# Altium schematic sheet UV_Watch_1.SchDoc (part 2 of 2)
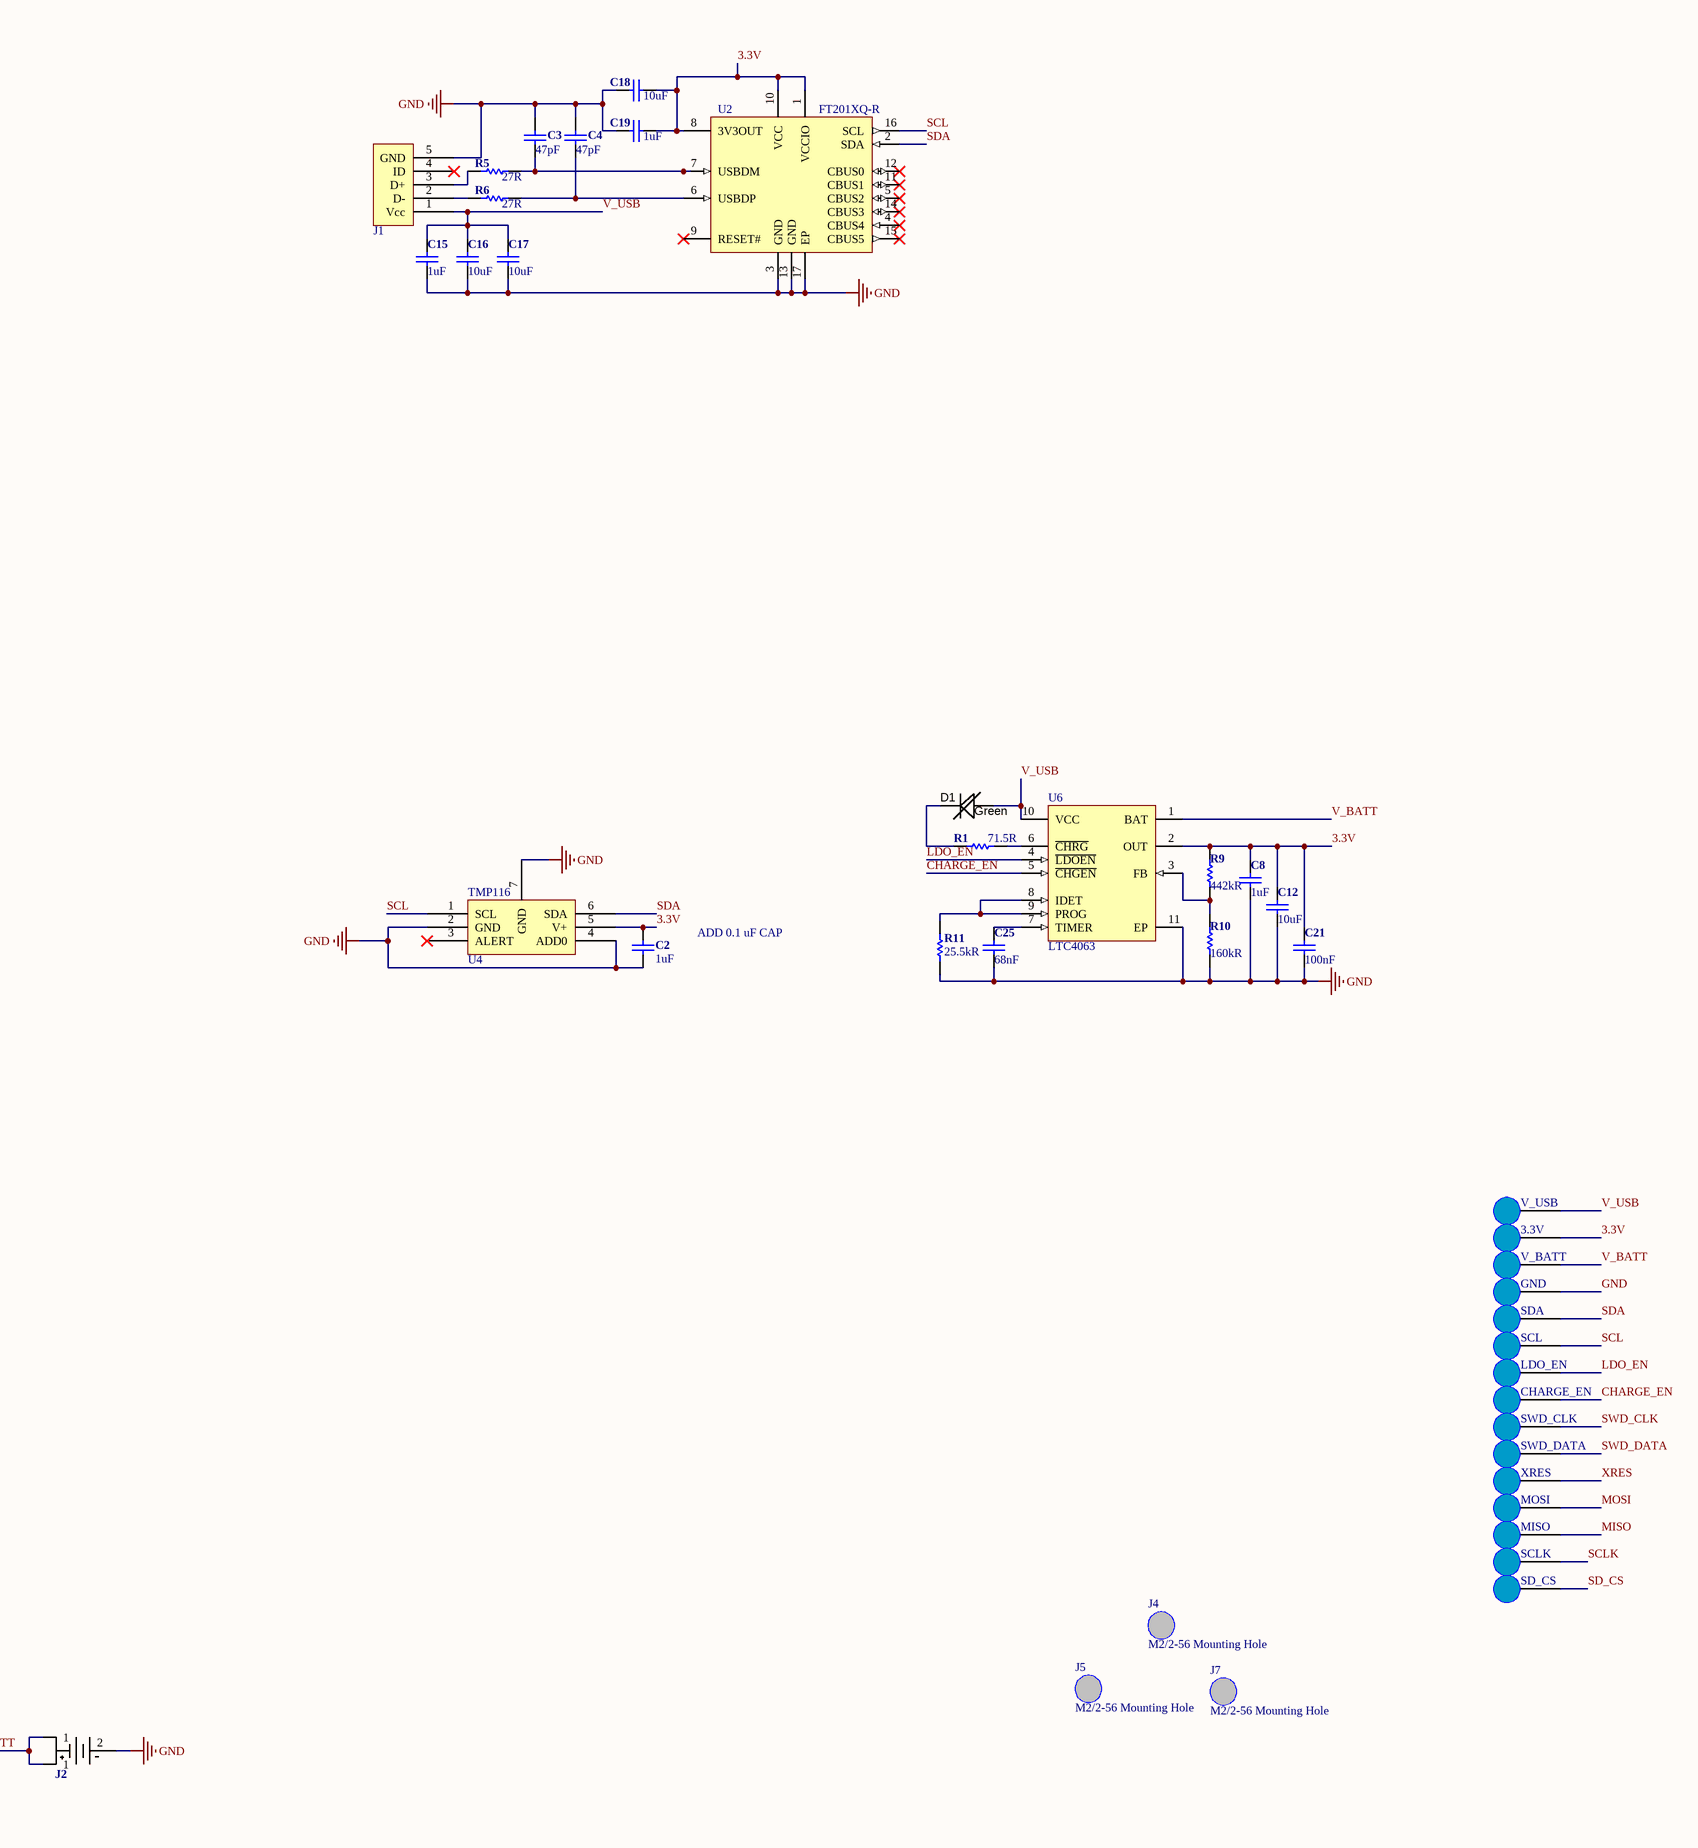
[diagram p2: UV_Watch_1.SchDoc, right]

## Library data of the parts
3.3V CHARGE_EN GND LDO_EN MISO MOSI SCL SCLK SD_CS SDA SWD_CLK SWD_DATA V_BATT V_USB XRES = Pogo-Pin Pad: Manufacturer: Harwin; Manufacturer Part Number: P13-2123; Description 1: HARWIN         P13-2123             PROBE, CONVEX, 1.27MM PITCH; Body Material: Bronze; Body Plating: Gold; Resistance: 0.03R; Current Rating: 3A; Contact Resistance: 30mR; Gender: Male; Mating Cycles: 1000000; Supplier 1: Mouser; Supplier Part Number 1: 855-P13-2123; Stock 1: 1373; Pricing 1: 1=3.36, 10=3.22, 50=2.82, 100=2.69, 1000=1.95, 10000=1.82 (USD); Material: Bronze; Contact Material: Copper; Min Operating Temperature: -40°C; Max Operating Temperature: 85°C; Package Quantity: 500; Length: 0.652inch; Depth: 1mm; Radiation Hardening: No; REACH SVHC: No SVHC; ComponentLink1URL: https://datasheet.ciiva.com/1454/1498711-1454531.pdf; ComponentLink1Description: https://datasheet.ciiva.com/1454/1498711-1454531.pdf; ComponentLink2URL: https://datasheet.ciiva.com/5229/p13-xx23-351008-5229722.pdf; ComponentLink2Description: https://datasheet.ciiva.com/5229/p13-xx23-351008-5229722.pdf
C1 C12 C13 C16-C18 = C-0805(2012): ___ OHM ___ mW 0805(2012) SMD; Manufacturer: Yageo; Manufacturer Part Number: CC0805ZKY5V5BB106; Description 1: CAP CER 10UF 6.3V Y5V 0805; Voltage Rating: 6.3V; Tolerance: 80%; Dielectric: Y5V; Supplier 1: Mouser; Supplier Part Number 1: 603-CC805ZKY5V5BB106; Stock 1: 8650; Pricing 1: 1=0.15, 10=0.076, 50=0.076, 100=0.033, 1000=0.027, 10000=0.023 (USD); Mount: Surface Mount; Case/Package: 0805; Number of Pins: 2; Case Code (Metric): 2012; Case Code (Imperial): 0805; Min Operating Temperature: -30°C; Max Operating Temperature: 85°C; Package Quantity: 1; Capacitance: 10uF; Packaging: Tape and Reel; Voltage Rating (DC): 6.3V; Composition: Ceramic; Length: 2mm; Height: 1.25mm; Width: 0.049inch; Thickness: 0.057inch; Depth: 1.25mm; Radiation Hardening: No; Lead Free: Lead Free; Halogen Free: Halogen Free; ComponentLink1URL: https://datasheet.ciiva.com/180/mlccorderingcode-180353.pdf; ComponentLink1Description: https://datasheet.ciiva.com/180/mlccorderingcode-180353.pdf; ComponentLink2URL: https://datasheet.ciiva.com/180/mlccorderingcode-180354.pdf; ComponentLink2Description: https://datasheet.ciiva.com/180/mlccorderingcode-180354.pdf; ComponentLink3URL: https://datasheet.ciiva.com/180/mlccorderingcode-180355.pdf; ComponentLink3Description: https://datasheet.ciiva.com/180/mlccorderingcode-180355.pdf; ComponentLink4URL: https://datasheet.ciiva.com/11465/upy-gphc-y5v-6-3v-to-50v-5-11465830.pdf; ComponentLink4Description: https://datasheet.ciiva.com/11465/upy-gphc-y5v-6-3v-to-50v-5-11465830.pdf; ComponentLink5URL: https://datasheet.ciiva.com/17436/upy-gphc-y5v-6-3v-to-50v-5-17436535.pdf; ComponentLink5Description: https://datasheet.ciiva.com/17436/upy-gphc-y5v-6-3v-to-50v-5-17436535.pdf; ComponentLink6URL: https://datasheet.ciiva.com/13211/upy-gp-np0-16v-to-50v-8-13211102.pdf; ComponentLink6Description: https://datasheet.ciiva.com/13211/upy-gp-np0-16v-to-50v-8-13211102.pdf
C2 C5 C8 C11 C15 C19 C20 C23 C24 = C-0805(2012): ___ OHM ___ mW 0805(2012) SMD; Manufacturer: Yageo; Manufacturer Part Number: CC0805KKX7R5BB105; Description 1: Cap Ceramic 1uF 6.3V X7R 10% SMD 0805 125C Blister T/R; Tolerance: 10%; Voltage Rating (DC): 6.3V; Dielectric: X7R; Supplier 1: Mouser; Supplier Part Number 1: 603-CC805KKX7R5BB105; Stock 1: 7735; Mount: Surface Mount; Case/Package: 0805; Weight: 0.000194oz; Case Code (Imperial): 0805; Case Code (Metric): 2012; Min Operating Temperature: -55°C; Max Operating Temperature: 125°C; Capacitance: 1uF; Packaging: Tape and Reel; Voltage Rating: 6.3V; Termination: SMD/SMT; Composition: Ceramic; Length: 2mm; Height: 1.25mm; Width: 0.049inch; Thickness: 0.057inch; Depth: 1.25mm; Radiation Hardening: No; Lead Free: Lead Free; Halogen Free: Halogen Free; ComponentLink1URL: https://datasheet.ciiva.com/13207/upy-gp-np0-16v-to-50v-8-13207753.pdf; ComponentLink1Description: https://datasheet.ciiva.com/13207/upy-gp-np0-16v-to-50v-8-13207753.pdf
  C2 C5 C8 C11 C15 C19 C20: Pricing 1: 1=0.14, 10=0.075, 50=0.075, 100=0.034, 1000=0.028, 10000=0.019 (USD)
  C23 C24: Pricing 1: 1=0.14, 10=0.075, 50=0.075, 100=0.034, 1000=0.028, 10000=0.02 (USD)
C3 C4 = C-0805(2012): ___ OHM ___ mW 0805(2012) SMD; Manufacturer: Vishay Vitramon; Manufacturer Part Number: VJ0805A470GXQPW1BC; Description 1: Multilayer Ceramic Capacitors MLCC - SMD/SMT 0805 47pF 10volts C0G 2%; Dielectric Material: Tantalum; Tolerance: 2%; Dielectric: C0G; Voltage Rating (DC): 10V; Supplier 1: Mouser; Supplier Part Number 1: 77-VJ0805A470GXQPBC; Stock 1: 31864; Pricing 1: 1=0.13, 10=0.13, 50=0.06, 100=0.044, 1000=0.026, 10000=0.026 (USD); Mount: Surface Mount; Case/Package: 0805; Weight: 0.000194oz; Case Code (Imperial): 0805; Case Code (Metric): 2012; Min Operating Temperature: -55°C; Max Operating Temperature: 125°C; Package Quantity: 15000; Packaging: Tape and Reel; Capacitance: 47pF; Termination: SMD/SMT; Length: 2mm; Height: 1.45mm; Width: 1.25mm; Depth: 1.25mm; Lead Free: Lead Free; ComponentLink1URL: https://datasheet.ciiva.com/11480/vjw1bcbascomseries-11480789.pdf; ComponentLink1Description: https://datasheet.ciiva.com/11480/vjw1bcbascomseries-11480789.pdf
C6 C9 C14 C21 C22 = C-0805(2012): ___ OHM ___ mW 0805(2012) SMD; Manufacturer: Wurth Electronics; Manufacturer Part Number: 885012207016; Description 1: 0.10µF 10V Ceramic Capacitor X7R 0805 (2012 Metric) 0.079" L x 0.049" W (2.00mm x 1.25mm); Voltage Rating: 10V; Tolerance: 10%; Supplier 1: Mouser; Supplier Part Number 1: 710-885012207016; Stock 1: 8228; Pricing 1: 1=0.08, 10=0.07, 50=0.05, 100=0.05, 1000=0.025, 10000=0.021 (USD); Mount: Surface Mount; Case/Package: 0805; Case Code (Metric): 2012; Case Code (Imperial): 0805; Min Operating Temperature: -55°C; Max Operating Temperature: 125°C; Packaging: Cut Tape; Capacitance: 100nF; Length: 0.079inch; Width: 0.049inch; Thickness: 0.035inch
C7 C10 = C-0805(2012): ___ OHM ___ mW 0805(2012) SMD; Manufacturer: Vishay Vitramon; Manufacturer Part Number: VJ0805Y103MXQPW1BC; Description 1: Multilayer Ceramic Capacitors MLCC - SMD/SMT 0805 0.01uF 10volts X7R 20%; Dielectric Material: Tantalum; Tolerance: 20%; Voltage Rating (DC): 10V; Dielectric: X7R; Supplier 1: Mouser; Supplier Part Number 1: 77-VJ0805Y103MXQPBC; Stock 1: 23611; Pricing 1: 1=0.1, 10=0.1, 50=0.07, 100=0.058, 1000=0.022, 10000=0.022 (USD); Mount: Surface Mount; Case/Package: 0805; Case Code (Imperial): 0805; Case Code (Metric): 2012; Min Operating Temperature: -55°C; Max Operating Temperature: 125°C; Capacitance: 10nF; Packaging: Tape and Reel; Package Quantity: 15000; Termination: SMD/SMT; Length: 2mm; Height: 1.45mm; Width: 1.25mm; Depth: 1.25mm; Lead Free: Lead Free; ComponentLink1URL: https://datasheet.ciiva.com/11497/vjw1bcbascomseries-11497433.pdf; ComponentLink1Description: https://datasheet.ciiva.com/11497/vjw1bcbascomseries-11497433.pdf
C25 = C-0805(2012): ___ OHM ___ mW 0805(2012) SMD; Manufacturer: Wurth Electronics; Manufacturer Part Number: 885012207044; Description 1: 0.068µF 16V Ceramic Capacitor X7R 0805 (2012 Metric) 0.079" L x 0.049" W (2.00mm x 1.25mm); Voltage Rating: 16V; Tolerance: 10%; Supplier 1: Mouser; Supplier Part Number 1: 710-885012207044; Stock 1: 3945; Pricing 1: 1=0.08, 10=0.07, 50=0.05, 100=0.05, 1000=0.025, 10000=0.021 (USD); Mount: Surface Mount; Case/Package: 0805; Case Code (Metric): 2012; Case Code (Imperial): 0805; Min Operating Temperature: -55°C; Max Operating Temperature: 125°C; Packaging: Tape and Reel; Capacitance: 68nF; Length: 0.079inch; Width: 0.049inch; Thickness: 0.035inch
D1 = LED_0805: LED, 0805 SMD; Manufacturer: Kingbright; Manufacturer Part Number: APHCM2012CGCK-F01; Description 1: LED 2X1.25MM LOPRO 570NM GRN SMD; Lens Colour: Clear; Luminous Intensity: 40mcd; Viewing Angle: 110°; Lens Style: Flat,Clear; Forward Current: 20mA; Forward Voltage: 2.1V; Dominant Wavelength: 570nm; Number of LEDs: 1; Supplier 1: Mouser; Supplier Part Number 1: 604-APHCM2012CGCK; Stock 1: 20488; Pricing 1: 1=0.2, 10=0.121, 50=0.121, 100=0.09, 1000=0.083, 10000=0.062 (USD); Mount: Surface Mount; Case/Package: 0805; Number of Pins: 2; Colour: Green; Case Code (Metric): 2012; Case Code (Imperial): 0805; Min Operating Temperature: -40°C; Max Operating Temperature: 85°C; Package Quantity: 1; Illumination Colour: Green; Packaging: Tape and Reel; Test Current: 20mA; Wavelength: 570nm; Length: 2mm; Height: 0.4mm; Width: 1.25mm; Lead Free: Lead Free; ComponentLink1URL: https://datasheet.ciiva.com/12403/aphcm2012cgck-f01-34366-12403909.pdf; ComponentLink1Description: https://datasheet.ciiva.com/12403/aphcm2012cgck-f01-34366-12403909.pdf; ComponentLink2URL: https://datasheet.ciiva.com/2113/aphcm2012cgck-f01-2113927.pdf; ComponentLink2Description: https://datasheet.ciiva.com/2113/aphcm2012cgck-f01-2113927.pdf; ComponentLink3URL: https://datasheet.ciiva.com/2113/aphcm2012cgck-f01-2113928.pdf; ComponentLink3Description: https://datasheet.ciiva.com/2113/aphcm2012cgck-f01-2113928.pdf; ComponentLink4URL: https://datasheet.ciiva.com/2113/aphcm2012cgck-f01-2113929.pdf; ComponentLink4Description: https://datasheet.ciiva.com/2113/aphcm2012cgck-f01-2113929.pdf; ComponentLink5URL: https://datasheet.ciiva.com/16494/aphcm2012cgck-f01-16494095.pdf; ComponentLink5Description: https://datasheet.ciiva.com/16494/aphcm2012cgck-f01-16494095.pdf
D2 = LED_0805: LED, 0805 SMD; Manufacturer: Kingbright; Manufacturer Part Number: APT2012LSECK/J4-PRV; Description 1: Orange 605nm LED Indication - Discrete 1.8V 0805 (2012 Metric); Lens Colour: Colorless; Lens Transparency: Clear; Luminous Intensity: 50mcd; Test Current: 2mA; Viewing Angle: 120°; Dominant Wavelength: 605nm; Forward Voltage: 1.8V; Supplier 1: Mouser; Supplier Part Number 1: 604-APT2012LSECKJ4RV; Stock 1: 9142; Pricing 1: 1=0.49, 10=0.304, 50=0.304, 100=0.226, 1000=0.176, 10000=0.137 (USD); Mount: Surface Mount; Case/Package: 0805; Colour: Orange; Case Code (Metric): 2012; Case Code (Imperial): 0805; Packaging: Tape and Reel; Length: 2mm; Height: 0.75mm; Width: 1.25mm; ComponentLink1URL: http://www.kingbrightusa.com/images/catalog/SPEC/APT2012LSECK-J4-PRV.pdf; ComponentLink1Description: http://www.kingbrightusa.com/images/catalog/SPEC/APT2012LSECK-J4-PRV.pdf; ComponentLink2URL: http://www.mouser.com/ds/2/216/APT2012LSECK-J4-PRV-535760.pdf; ComponentLink2Description: http://www.mouser.com/ds/2/216/APT2012LSECK-J4-PRV-535760.pdf
D3 = LED_0805: LED, 0805 SMD; Manufacturer: Kingbright; Manufacturer Part Number: APT2012LSECK/J3-PRV; Description 1: Red 625nm LED Indication - Discrete 1.8V 0805 (2012 Metric); Lens Colour: Colorless; Lens Transparency: Clear; Luminous Intensity: 40mcd; Test Current: 2mA; Viewing Angle: 120°; Dominant Wavelength: 625nm; Forward Voltage: 1.8V; Supplier 1: Mouser; Supplier Part Number 1: 604-APT2012LSECKJ3RV; Stock 1: 7340; Pricing 1: 1=0.49, 10=0.305, 50=0.305, 100=0.226, 1000=0.177, 10000=0.138 (USD); Mount: Surface Mount; Case/Package: 0805; Colour: Red; Case Code (Metric): 2012; Case Code (Imperial): 0805; Packaging: Tape and Reel; Length: 2mm; Height: 0.75mm; Width: 1.25mm; ComponentLink1URL: http://www.mouser.com/ds/2/216/APT2012LSECK-J3-PRV-535674.pdf; ComponentLink1Description: http://www.mouser.com/ds/2/216/APT2012LSECK-J3-PRV-535674.pdf; ComponentLink2URL: http://www.kingbrightusa.com/images/catalog/SPEC/APT2012LSECK-J3-PRV.pdf; ComponentLink2Description: http://www.kingbrightusa.com/images/catalog/SPEC/APT2012LSECK-J3-PRV.pdf
D4 = LED_0805: LED, 0805 SMD; Manufacturer: Kingbright; Manufacturer Part Number: APTD2012LQBC/D; Description 2: Blue 470nm LED Indication - Discrete 2.65V 0805 (2012 Metric); Lens Colour: Colorless; Lens Transparency: Clear; Luminous Intensity: 24mcd; Test Current: 2mA; Viewing Angle: 120°; Dominant Wavelength: 470nm; Forward Voltage: 2.65V; Supplier 1: Mouser; Supplier Part Number 1: 604-APTD2012LQBCD; Stock 1: 5707; Pricing 1: 1=0.46, 10=0.293, 50=0.293, 100=0.239, 1000=0.174, 10000=0.14 (USD); Supplier 2: Mouser; Supplier Part Number 2: 604-APT2012LVBCD; Stock 2: 2478; Pricing 2: 1=0.49, 10=0.313, 50=0.313, 100=0.256, 1000=0.186, 10000=0.15 (USD); Mount: Surface Mount; Case/Package: 0805; Colour: Blue; Case Code (Metric): 2012; Case Code (Imperial): 0805; Packaging: Tape and Reel; Length: 2mm; Height: 0.75mm; Width: 1.25mm; Lead Free: Lead Free; ComponentLink1URL: http://www.mouser.com/ds/2/216/APT2012LVBC-D-535767.pdf; ComponentLink1Description: http://www.mouser.com/ds/2/216/APT2012LVBC-D-535767.pdf; ComponentLink2URL: http://www.kingbrightusa.com/images/catalog/SPEC/APT2012LVBC-D.pdf; ComponentLink2Description: http://www.kingbrightusa.com/images/catalog/SPEC/APT2012LVBC-D.pdf
J1 = USB: USB_Connector_5P_MICRO_USB_FCI; Manufacturer: Amphenol FCI; Manufacturer Part Number: 10118194-0001LF; Connector Type: USB - micro B; Number of Contacts: 5; Gender: Receptacle; Specifications: USB 2.0; Number of Ports: 1; Current Rating: 1.8A per Contact; Voltage - Rated: 100VAC; Mating Cycles: 10000; Shielding: Shielded; Material Flammability Rating: UL94 V-0; Supplier 1: Digi-Key; RoHS: RoHS Compliant; Category: Connectors, Interconnects; Stock 1: 267893; Pricing 1: 1=0.46, 10=0.437, 25=0.3744, 50=0.318, 100=0.3056, 250=0.27444, 500=0.26196 (USD); Packaging: Cut Tape (CT); Part Status: Active; Mounting Type: Surface Mount, Right Angle; Through Hole; Mounting Feature: Horizontal; Termination: Solder; Features: Solder Retention; Ingress Protection: -; Operating Temperature: -30°C ~ 80°C; Contact Finish: Gold; Shell/Shielding Material: Steel, Stainless; Insulation Color: Black; ComponentLink1URL: http://portal.fciconnect.com/Comergent//fci/drawing/10118194.pdf; ComponentLink1Description: http://portal.fciconnect.com/Comergent//fci/drawing/10118194.pdf; Supplier Part Number 1: 609-4618-1-ND
J2 = BAT-HLD-001: Header, 2 pin, .1 pitch; Manufacturer: Linx; Description 1: HOLDER BATTERY 20MM COIN; Number of Cells: 1; Supplier 1: Mouser; Supplier Part Number 1: 712-BAT-HLD-001; Manufacturer Part Number: BAT-HLD-001; Stock 1: 81336; Pricing 1: 1=0.28, 10=0.28, 50=0.257, 100=0.233, 1000=0.204, 10000=0.183 (USD); Mount: Surface Mount,PCB; Package Quantity: 1000; Packaging: Bulk; Termination: SMD/SMT; Lead Free: Lead Free; ComponentLink1URL: https://datasheet.ciiva.com/4/bat-hld-001-4035.pdf; ComponentLink1Description: https://datasheet.ciiva.com/4/bat-hld-001-4035.pdf; ComponentLink2URL: https://datasheet.ciiva.com/4642/bat-hld-001-220194-4642567.pdf; ComponentLink2Description: https://datasheet.ciiva.com/4642/bat-hld-001-220194-4642567.pdf; ComponentLink3URL: https://datasheet.ciiva.com/16207/bat-hld-001-16207212.pdf; ComponentLink3Description: https://datasheet.ciiva.com/16207/bat-hld-001-16207212.pdf
J3 = 693071010811: Wurth CONN MICRO SD CARD PUSH-PUSH R/A; Manufacturer: Wurth Electronics; Description 1: WURTH ELEKTRONIK         693071010811             CONNECTOR, MICRO SD, SMT, R/A, 8WAY; Connector Type: Connector; Number of Contacts: 8; Supplier 1: Digi-Key; Supplier Part Number 1: 732-3819-1-ND; Manufacturer Part Number: 693071010811; Stock 1: 4983; Pricing 1: 1=2.92, 10=2.856, 50=2.513, 100=2.399, 500=2.056 (USD); Mount: Surface Mount; Contact Material: Copper,Gold,Copper Alloy; Contact Plating: Gold; Min Operating Temperature: -25°C; Max Operating Temperature: 85°C; Package Quantity: 1; Packaging: Tape and Reel; Length: 14mm; Height: 1.98mm; Width: 15.2mm; REACH SVHC: Unknown; Lead Free: Lead Free; ComponentLink1URL: https://datasheet.ciiva.com/6935/693071010811-6935152.pdf; ComponentLink1Description: https://datasheet.ciiva.com/6935/693071010811-6935152.pdf; ComponentLink2URL: https://datasheet.ciiva.com/25605/0900766b81113f2e-25605369.pdf; ComponentLink2Description: https://datasheet.ciiva.com/25605/0900766b81113f2e-25605369.pdf; ComponentLink3URL: https://datasheet.ciiva.com/6935/693071010811-6935146.pdf; ComponentLink3Description: https://datasheet.ciiva.com/6935/693071010811-6935146.pdf; ComponentLink4URL: https://datasheet.ciiva.com/1104/1759178-1104796.pdf; ComponentLink4Description: https://datasheet.ciiva.com/1104/1759178-1104796.pdf
R1 = R-0805(2012): ___ OHM ___ mW 0805(2012) SMD; Manufacturer: Yageo; Manufacturer Part Number: RC0805FR-0771R5L; Description 1: RES SMD 71.5 OHM 1% 1/8W 0805; Tolerance: 1%; Power Rating: 125mW; Voltage Rating (DC): 150V; Supplier 1: Mouser; Supplier Part Number 1: 603-RC0805FR-0771R5L; Stock 1: 25750; Pricing 1: 1=0.1, 10=0.015, 50=0.015, 100=0.005, 1000=0.004, 10000=0.003 (USD); Case/Package: 0805; Resistance: 71.5R; Lead Free: Lead Free; ComponentLink1URL: http://components.arrow.com/part/dataview/0323_00201025; ComponentLink1Description: http://components.arrow.com/part/dataview/0323_00201025; ComponentLink2URL: http://www.yageo.com.tw/exep/pages/download/literatures/PYu-R_INT-thick_7.pdf; ComponentLink2Description: http://www.yageo.com.tw/exep/pages/download/literatures/PYu-R_INT-thick_7.pdf
R2 = R-0805(2012): ___ OHM ___ mW 0805(2012) SMD; Manufacturer: Yageo; Manufacturer Part Number: AC0805JR-071KL; Description 1: Thick Film Resistors - SMD 1/8W 1 kOhm 5%; Tolerance: 5%; Power Rating: 125mW; Voltage Rating: 150V; Temperature Coefficient: 100ppm/°C; Supplier 1: Mouser; Supplier Part Number 1: 603-AC0805JR-071KL; Stock 1: 51600; Pricing 1: 1=0.1, 10=0.023, 50=0.023, 100=0.008, 1000=0.006, 10000=0.003 (USD); Case/Package: 0805; Case Code (Imperial): 0805; Case Code (Metric): 2012; Contact Plating: Tin,Matte; Min Operating Temperature: -55°C; Max Operating Temperature: 155°C; Resistance: 1kR; Packaging: Tape and Reel; Composition: Thick Film; Termination: SMD/SMT; Number of Terminations: 2; Max Power Dissipation: 125mW; Length: 0.079inch; Height: 0.024inch; Width: 1.25mm; Radiation Hardening: No; Lead Free: Lead Free; ComponentLink1URL: http://www.yageo.com/documents/recent/PYu-AC_51_RoHS_L_2_revised.pdf; ComponentLink1Description: http://www.yageo.com/documents/recent/PYu-AC_51_RoHS_L_2_revised.pdf; ComponentLink2URL: http://www.mouser.com/ds/2/447/yageodocoutput-1111992.pdf; ComponentLink2Description: http://www.mouser.com/ds/2/447/yageodocoutput-1111992.pdf; ComponentLink3URL: http://www.yageo.com/NewPortal/yageodocoutput?fileName=/pdf/R-Chip/PYu-AC_51_RoHS_L_6.pdf; ComponentLink3Description: http://www.yageo.com/NewPortal/yageodocoutput?fileName=/pdf/R-Chip/PYu-AC_51_RoHS_L_6.pdf
R3 = R-0805(2012): ___ OHM ___ mW 0805(2012) SMD; Manufacturer: Yageo; Manufacturer Part Number: RC0805FR-07150RL; Description 1: RES SMD 150 OHM 1% 1/8W 0805; Power Rating: 125mW; Tolerance: 1%; Voltage Rating: 150V; Temperature Coefficient: 100ppm/°C; Supplier 1: Mouser; Supplier Part Number 1: 603-RC0805FR-07150RL; Stock 1: 18073; Pricing 1: 1=0.1, 10=0.016, 50=0.016, 100=0.006, 1000=0.004, 10000=0.003 (USD); Case/Package: 0805; Number of Pins: 2; Case Code (Metric): 2012; Case Code (Imperial): 0805; Min Operating Temperature: -55°C; Max Operating Temperature: 155°C; Resistance: 150R; Voltage Rating (DC): 150V; Package Quantity: 1; Packaging: Tape and Reel; Composition: Thick Film; Number of Terminations: 2; Termination: SMD/SMT; Military Standard: Not; Max Power Dissipation: 125mW; Length: 2mm; Height: 0.024inch; Width: 0.049inch; Depth: 1.25mm; REACH SVHC: Unknown; Lead Free: Lead Free; ComponentLink1URL: https://datasheet.ciiva.com/11819/0900766b8106beab-11819782.pdf; ComponentLink1Description: https://datasheet.ciiva.com/11819/0900766b8106beab-11819782.pdf; ComponentLink2URL: https://datasheet.ciiva.com/2456/pyu-r-int-thick-7-2456999.pdf; ComponentLink2Description: https://datasheet.ciiva.com/2456/pyu-r-int-thick-7-2456999.pdf; ComponentLink3URL: https://datasheet.ciiva.com/2457/pyu-r-int-thick-7-2457000.pdf; ComponentLink3Description: https://datasheet.ciiva.com/2457/pyu-r-int-thick-7-2457000.pdf; ComponentLink4URL: https://datasheet.ciiva.com/2457/pyu-r-int-thick-7-2457001.pdf; ComponentLink4Description: https://datasheet.ciiva.com/2457/pyu-r-int-thick-7-2457001.pdf; ComponentLink5URL: https://datasheet.ciiva.com/12668/rc0805-12668251.pdf; ComponentLink5Description: https://datasheet.ciiva.com/12668/rc0805-12668251.pdf; ComponentLink6URL: https://datasheet.ciiva.com/7660/38627-7660798.pdf; ComponentLink6Description: https://datasheet.ciiva.com/7660/38627-7660798.pdf; ComponentLink7URL: https://datasheet.ciiva.com/46447/444164-46447566.pdf; ComponentLink7Description: https://datasheet.ciiva.com/46447/444164-46447566.pdf
R4 R8 R12-R14 R18 R20 = R-0805(2012): ___ OHM ___ mW 0805(2012) SMD; Manufacturer: Yageo; Manufacturer Part Number: AC0805JR-074K7L; Description 1: Thick Film Resistors - SMD 1/8W 4.7K ohm 5%; Power Rating: 125mW; Tolerance: 5%; Voltage Rating: 150V; Temperature Coefficient: 100ppm/°C; Supplier 1: Mouser; Supplier Part Number 1: 603-AC0805JR-074K7L; Pricing 1: 1=0.1, 10=0.023, 50=0.023, 100=0.008, 1000=0.006, 10000=0.003 (USD); Case/Package: 0805; Case Code (Imperial): 0805; Case Code (Metric): 2012; Contact Plating: Tin,Matte; Min Operating Temperature: -55°C; Max Operating Temperature: 155°C; Packaging: Tape and Reel; Resistance: 4.7kR; Composition: Thick Film; Termination: SMD/SMT; Number of Terminations: 2; Max Power Dissipation: 125mW; Length: 0.079inch; Height: 0.024inch; Width: 1.25mm; Radiation Hardening: No; ComponentLink1URL: http://www.mouser.com/ds/2/447/yageodocoutput-1111992.pdf; ComponentLink1Description: http://www.mouser.com/ds/2/447/yageodocoutput-1111992.pdf; ComponentLink2URL: http://www.yageo.com/NewPortal/yageodocoutput?fileName=/pdf/R-Chip/PYu-AC_51_RoHS_L_6.pdf; ComponentLink2Description: http://www.yageo.com/NewPortal/yageodocoutput?fileName=/pdf/R-Chip/PYu-AC_51_RoHS_L_6.pdf; ComponentLink3URL: http://www.yageo.com/documents/recent/PYu-AC_51_RoHS_L_2_revised.pdf; ComponentLink3Description: http://www.yageo.com/documents/recent/PYu-AC_51_RoHS_L_2_revised.pdf
  R4 R12 R13: Stock 1: 79084
  R8 R14 R18 R20: Stock 1: 78734
R5 R6 = R-0805(2012): ___ OHM ___ mW 0805(2012) SMD; Manufacturer: Yageo; Manufacturer Part Number: RC0805JR-0727RL; Description 1: RES SMD 27 OHM 5% 1/8W 0805; Power Rating: 125mW; Tolerance: 5%; Voltage Rating: 150V; Temperature Coefficient: 100ppm/°C; Supplier 1: Mouser; Supplier Part Number 1: 603-RC0805JR-0727RL; Stock 1: 4359; Pricing 1: 1=0.1, 10=0.013, 50=0.013, 100=0.005, 1000=0.003, 10000=0.003 (USD); Case/Package: 0805; Weight: 0.000194oz; Case Code (Metric): 2012; Case Code (Imperial): 0805; Contact Plating: Tin,Lead,Matte; Min Operating Temperature: -55°C; Max Operating Temperature: 155°C; Resistance: 27R; Package Quantity: 1; Packaging: Tape and Reel; Composition: Thick Film; Number of Terminations: 2; Termination: SMD/SMT; Military Standard: Not; Max Power Dissipation: 125mW; Length: 2mm; Height: 0.024inch; Width: 0.049inch; Depth: 1.25mm; Radiation Hardening: No; REACH SVHC: Unknown; Lead Free: Lead Free; ComponentLink1URL: https://datasheet.ciiva.com/2456/pyu-r-int-thick-7-2456049.pdf; ComponentLink1Description: https://datasheet.ciiva.com/2456/pyu-r-int-thick-7-2456049.pdf; ComponentLink2URL: https://datasheet.ciiva.com/2456/pyu-r-int-thick-7-2456050.pdf; ComponentLink2Description: https://datasheet.ciiva.com/2456/pyu-r-int-thick-7-2456050.pdf; ComponentLink3URL: https://datasheet.ciiva.com/2456/pyu-r-int-thick-7-2456051.pdf; ComponentLink3Description: https://datasheet.ciiva.com/2456/pyu-r-int-thick-7-2456051.pdf; ComponentLink4URL: https://datasheet.ciiva.com/17050/rc0805-17050396.pdf; ComponentLink4Description: https://datasheet.ciiva.com/17050/rc0805-17050396.pdf; ComponentLink5URL: https://datasheet.ciiva.com/7941/442941-7941933.pdf; ComponentLink5Description: https://datasheet.ciiva.com/7941/442941-7941933.pdf; ComponentLink6URL: https://datasheet.ciiva.com/7941/442941-7941934.pdf; ComponentLink6Description: https://datasheet.ciiva.com/7941/442941-7941934.pdf; ComponentLink7URL: https://datasheet.ciiva.com/12577/rc0805-12577759.pdf; ComponentLink7Description: https://datasheet.ciiva.com/12577/rc0805-12577759.pdf
R7 R19 R21 R24 = R-0805(2012): ___ OHM ___ mW 0805(2012) SMD; Manufacturer: Yageo; Manufacturer Part Number: RC0805FR-07100KL; Description 1: RES SMD 100K OHM 1% 1/8W 0805; Tolerance: 1%; Voltage Rating (DC): 150V; Temperature Coefficient: 100ppm/°C; Power Rating: 125mW; Supplier 1: Mouser; Supplier Part Number 1: 603-RC0805FR-07100KL; Pricing 1: 1=0.1, 10=0.016, 50=0.016, 100=0.006, 1000=0.004, 10000=0.003 (USD); Case/Package: 0805; Number of Pins: 2; Case Code (Metric): 2012; Case Code (Imperial): 0805; Min Operating Temperature: -55°C; Max Operating Temperature: 155°C; Resistance: 100kR; Packaging: Tape and Reel; Composition: Thick Film; Voltage Rating: 150V; Package Quantity: 1; Number of Terminations: 2; Termination: SMD/SMT; Military Standard: Not; Max Power Dissipation: 125mW; Length: 2mm; Height: 0.024inch; Width: 0.049inch; Depth: 1.25mm; Lead Pitch: 0.4mm; REACH SVHC: Unknown; Lead Free: Lead Free; ComponentLink1URL: https://datasheet.ciiva.com/2457/pyu-r-int-thick-7-2457017.pdf; ComponentLink1Description: https://datasheet.ciiva.com/2457/pyu-r-int-thick-7-2457017.pdf; ComponentLink2URL: https://datasheet.ciiva.com/12667/rc0805-12667001.pdf; ComponentLink2Description: https://datasheet.ciiva.com/12667/rc0805-12667001.pdf; ComponentLink3URL: https://datasheet.ciiva.com/2457/pyu-r-int-thick-7-2457018.pdf; ComponentLink3Description: https://datasheet.ciiva.com/2457/pyu-r-int-thick-7-2457018.pdf; ComponentLink4URL: https://datasheet.ciiva.com/11808/0900766b8106beab-11808858.pdf; ComponentLink4Description: https://datasheet.ciiva.com/11808/0900766b8106beab-11808858.pdf; ComponentLink5URL: https://datasheet.ciiva.com/16747/rc0805-16747226.pdf; ComponentLink5Description: https://datasheet.ciiva.com/16747/rc0805-16747226.pdf; ComponentLink6URL: https://datasheet.ciiva.com/2457/pyu-r-int-thick-7-2457019.pdf; ComponentLink6Description: https://datasheet.ciiva.com/2457/pyu-r-int-thick-7-2457019.pdf; ComponentLink7URL: https://datasheet.ciiva.com/7660/38627-7660796.pdf; ComponentLink7Description: https://datasheet.ciiva.com/7660/38627-7660796.pdf; ComponentLink8URL: https://datasheet.ciiva.com/7941/1697719-7941676.pdf; ComponentLink8Description: https://datasheet.ciiva.com/7941/1697719-7941676.pdf; ComponentLink9URL: https://datasheet.ciiva.com/7941/1686128-7941677.pdf; ComponentLink9Description: https://datasheet.ciiva.com/7941/1686128-7941677.pdf; ComponentLink10URL: https://datasheet.ciiva.com/7941/1697719-7941678.pdf; ComponentLink10Description: https://datasheet.ciiva.com/7941/1697719-7941678.pdf; ComponentLink11URL: https://datasheet.ciiva.com/22747/444164-22747534.pdf; ComponentLink11Description: https://datasheet.ciiva.com/22747/444164-22747534.pdf
  R7 R19 R21: Stock 1: 159583
  R24: Stock 1: 94214
R9 = R-0805(2012): ___ OHM ___ mW 0805(2012) SMD; Manufacturer: Yageo; Manufacturer Part Number: RC0805FR-07442KL; Description 1: Thick Film Resistors - SMD 442K OHM 1%; Tolerance: 1%; Power Rating: 125mW; Voltage Rating: 150V; Temperature Coefficient: 100ppm/°C; Supplier 1: Mouser; Supplier Part Number 1: 603-RC0805FR-07442KL; Stock 1: 22218; Pricing 1: 1=0.1, 10=0.016, 50=0.016, 100=0.006, 1000=0.004, 10000=0.003 (USD); Case/Package: 0805; Case Code (Imperial): 0805; Case Code (Metric): 2012; Contact Plating: Tin,Matte; Min Operating Temperature: -55°C; Max Operating Temperature: 155°C; Resistance: 442kR; Packaging: Tape and Reel; Termination: SMD/SMT; Composition: Thick Film; Military Standard: Not; Voltage Rating (DC): 150V; Length: 2mm; Height: 0.5mm; Width: 1.25mm; Depth: 1.25mm; Radiation Hardening: No; Lead Free: Lead Free; ComponentLink1URL: http://www.mouser.com/ds/2/447/Yageo_08112016_RC0805-968729.pdf; ComponentLink1Description: http://www.mouser.com/ds/2/447/Yageo_08112016_RC0805-968729.pdf; ComponentLink2URL: http://components.arrow.com/part/dataview/0323_03537347; ComponentLink2Description: http://components.arrow.com/part/dataview/0323_03537347; ComponentLink3URL: http://www.yageo.com.tw/exep/pages/download/literatures/PYu-R_INT-thick_7.pdf; ComponentLink3Description: http://www.yageo.com.tw/exep/pages/download/literatures/PYu-R_INT-thick_7.pdf; ComponentLink4URL: http://www.yageo.com/documents/recent/PYu-RC0805_51_RoHS_L_5.pdf; ComponentLink4Description: http://www.yageo.com/documents/recent/PYu-RC0805_51_RoHS_L_5.pdf
R10 = R-0805(2012): ___ OHM ___ mW 0805(2012) SMD; Manufacturer: Yageo; Manufacturer Part Number: RC0805FR-07160KL; Description 1: RES SMD 160K OHM 1% 1/8W 0805; Tolerance: 1%; Power Rating: 125mW; Voltage Rating: 150V; Temperature Coefficient: 100ppm/°C; Supplier 1: Mouser; Supplier Part Number 1: 603-RC0805FR-07160KL; Stock 1: 12686; Pricing 1: 1=0.1, 10=0.016, 50=0.016, 100=0.006, 1000=0.004, 10000=0.003 (USD); Case/Package: 0805; Case Code (Metric): 2012; Case Code (Imperial): 0805; Min Operating Temperature: -55°C; Max Operating Temperature: 155°C; Package Quantity: 1; Resistance: 160kR; Packaging: Tape and Reel; Composition: Thick Film; Number of Terminations: 2; Termination: SMD/SMT; Max Power Dissipation: 125mW; Voltage Rating (DC): 150V; Length: 2mm; Height: 0.5mm; Width: 0.049inch; Depth: 1.25mm; Lead Free: Lead Free; ComponentLink1URL: https://datasheet.ciiva.com/11808/0900766b8106beab-11808868.pdf; ComponentLink1Description: https://datasheet.ciiva.com/11808/0900766b8106beab-11808868.pdf; ComponentLink2URL: https://datasheet.ciiva.com/17061/rc0805-17061772.pdf; ComponentLink2Description: https://datasheet.ciiva.com/17061/rc0805-17061772.pdf; ComponentLink3URL: https://datasheet.ciiva.com/2457/pyu-r-int-thick-7-2457005.pdf; ComponentLink3Description: https://datasheet.ciiva.com/2457/pyu-r-int-thick-7-2457005.pdf; ComponentLink4URL: https://datasheet.ciiva.com/2457/pyu-r-int-thick-7-2457006.pdf; ComponentLink4Description: https://datasheet.ciiva.com/2457/pyu-r-int-thick-7-2457006.pdf; ComponentLink5URL: https://datasheet.ciiva.com/2457/pyu-r-int-thick-7-2457007.pdf; ComponentLink5Description: https://datasheet.ciiva.com/2457/pyu-r-int-thick-7-2457007.pdf
R11 = R-0805(2012): ___ OHM ___ mW 0805(2012) SMD; Manufacturer: Yageo; Manufacturer Part Number: RC0805FR-0725K5L; Description 1: RES SMD 25.5K OHM 1% 1/8W 0805; Power Rating: 125mW; Tolerance: 1%; Voltage Rating: 150V; Temperature Coefficient: 100ppm/°C; Supplier 1: Mouser; Supplier Part Number 1: 603-RC0805FR-0725K5L; Stock 1: 6188; Pricing 1: 1=0.1, 10=0.016, 50=0.016, 100=0.006, 1000=0.004, 10000=0.003 (USD); Case/Package: 0805; Case Code (Metric): 2012; Case Code (Imperial): 0805; Min Operating Temperature: -55°C; Max Operating Temperature: 155°C; Package Quantity: 1; Resistance: 25.5kR; Packaging: Tape and Reel; Composition: Thick Film; Number of Terminations: 2; Termination: SMD/SMT; Military Standard: Not; Max Power Dissipation: 125mW; Voltage Rating (DC): 150V; Length: 0.079inch; Height: 0.024inch; Width: 0.049inch; Depth: 1.25mm; Lead Free: Lead Free; ComponentLink1URL: https://datasheet.ciiva.com/2509/pyu-r-int-thick-7-2509489.pdf; ComponentLink1Description: https://datasheet.ciiva.com/2509/pyu-r-int-thick-7-2509489.pdf; ComponentLink2URL: https://datasheet.ciiva.com/2509/pyu-r-int-thick-7-2509490.pdf; ComponentLink2Description: https://datasheet.ciiva.com/2509/pyu-r-int-thick-7-2509490.pdf; ComponentLink3URL: https://datasheet.ciiva.com/2509/pyu-r-int-thick-7-2509491.pdf; ComponentLink3Description: https://datasheet.ciiva.com/2509/pyu-r-int-thick-7-2509491.pdf; ComponentLink4URL: https://datasheet.ciiva.com/5558/rc0805-5558218.pdf; ComponentLink4Description: https://datasheet.ciiva.com/5558/rc0805-5558218.pdf
R15 R16 = R-0805(2012): ___ OHM ___ mW 0805(2012) SMD; Manufacturer: Yageo; Manufacturer Part Number: RC0805FR-0780R6L; Description 1: RES SMD 80.6 OHM 1% 1/8W 0805; Tolerance: 1%; Power Rating: 125mW; Voltage Rating: 150V; Temperature Coefficient: 100ppm/°C; Supplier 1: Mouser; Supplier Part Number 1: 603-RC0805FR-0780R6L; Stock 1: 39348; Pricing 1: 1=0.1, 10=0.016, 50=0.016, 100=0.006, 1000=0.004, 10000=0.003 (USD); Case/Package: 0805; Case Code (Imperial): 0805; Case Code (Metric): 2012; Contact Plating: Tin,Matte; Min Operating Temperature: -55°C; Max Operating Temperature: 155°C; Resistance: 80.6R; Packaging: Tape and Reel; Package Quantity: 1; Termination: SMD/SMT; Composition: Thick Film; Number of Terminations: 2; Military Standard: Not; Max Power Dissipation: 125mW; Voltage Rating (DC): 150V; Length: 2mm; Height: 0.024inch; Width: 1.25mm; Depth: 1.25mm; Radiation Hardening: No; Lead Free: Lead Free; ComponentLink1URL: https://datasheet.ciiva.com/12560/rc0805-257173-12560565.pdf; ComponentLink1Description: https://datasheet.ciiva.com/12560/rc0805-257173-12560565.pdf; ComponentLink2URL: https://datasheet.ciiva.com/2457/pyu-r-int-thick-7-2457350.pdf; ComponentLink2Description: https://datasheet.ciiva.com/2457/pyu-r-int-thick-7-2457350.pdf; ComponentLink3URL: https://datasheet.ciiva.com/2457/pyu-r-int-thick-7-2457351.pdf; ComponentLink3Description: https://datasheet.ciiva.com/2457/pyu-r-int-thick-7-2457351.pdf; ComponentLink4URL: https://datasheet.ciiva.com/2457/pyu-r-int-thick-7-2457352.pdf; ComponentLink4Description: https://datasheet.ciiva.com/2457/pyu-r-int-thick-7-2457352.pdf; ComponentLink5URL: https://datasheet.ciiva.com/17423/rc0805-17423022.pdf; ComponentLink5Description: https://datasheet.ciiva.com/17423/rc0805-17423022.pdf
R17 = R-0805(2012): ___ OHM ___ mW 0805(2012) SMD; Manufacturer: Yageo; Manufacturer Part Number: AC0805FR-07100RL; Description 1: Thick Film Resistors - SMD 1/8W 100ohm 1%; Tolerance: 1%; Power Rating: 125mW; Voltage Rating: 150V; Temperature Coefficient: 100ppm/°C; Supplier 1: Mouser; Supplier Part Number 1: 603-AC0805FR-07100RL; Stock 1: 44735; Pricing 1: 1=0.1, 10=0.043, 50=0.043, 100=0.018, 1000=0.007, 10000=0.005 (USD); Case/Package: 0805; Case Code (Imperial): 0805; Case Code (Metric): 2012; Min Operating Temperature: -55°C; Max Operating Temperature: 155°C; Resistance: 100R; Packaging: Tape and Reel; Composition: Thick Film; Number of Terminations: 2; Termination: SMD/SMT; Max Power Dissipation: 125mW; Length: 0.079inch; Height: 0.024inch; Width: 0.049inch; ComponentLink1URL: https://datasheet.ciiva.com/12656/pyu-ac-51-rohs-l-2-12656967.pdf; ComponentLink1Description: https://datasheet.ciiva.com/12656/pyu-ac-51-rohs-l-2-12656967.pdf
R22 R23 = R-0805(2012): ___ OHM ___ mW 0805(2012) SMD; Manufacturer: Yageo; Manufacturer Part Number: AC0805FR-0710KL; Description 1: RES SMD 10K OHM 1% 1/8W 0805; Tolerance: 1%; Power Rating: 125mW; Voltage Rating: 150V; Temperature Coefficient: 100ppm/°C; Supplier 1: Mouser; Supplier Part Number 1: 603-AC0805FR-0710KL; Stock 1: 335781; Pricing 1: 1=0.1, 10=0.043, 50=0.043, 100=0.018, 1000=0.007, 10000=0.005 (USD); Case/Package: 0805; Case Code (Metric): 2012; Case Code (Imperial): 0805; Min Operating Temperature: -55°C; Max Operating Temperature: 155°C; Packaging: Tape and Reel; Resistance: 10kR; Package Quantity: 1; Composition: Thick Film; Number of Terminations: 2; Termination: SMD/SMT; Military Standard: Not; Max Power Dissipation: 125mW; Length: 0.079inch; Height: 0.024inch; Width: 0.049inch; Depth: 1.25mm; Lead Free: Lead Free; ComponentLink1URL: https://datasheet.ciiva.com/5558/pyu-ac-51-rohs-l-2-5558347.pdf; ComponentLink1Description: https://datasheet.ciiva.com/5558/pyu-ac-51-rohs-l-2-5558347.pdf
SW1 = SW-SPST-2_C: Manufacturer: Omron; Manufacturer Part Number: B3U-3000P; Description 1: OMRON ELECTRONIC COMPONENTS         B3U-3000P            Tactile Switch, Non Illuminated, 1.59 N, 12 V, 50 mA, Solder, B3U Series; Mechanical Life: 100000Cycles; Operating Force: 1.59N; Contact Resistance: 100mR; Throw Configuration: SPST; Max Current Rating: 50mA; Voltage Rating (DC): 12V; Illumination Type: Non-Illuminated,Illuminated; Switch Travel: 0.2mm; Switch Function: Off-Mom; Actuator Length: 0.7mm; IP Rating: IP40,Dust Proof; Supplier 1: Mouser; Supplier Part Number 1: 653-B3U-3000P; Stock 1: 4217; Pricing 1: 1=0.97, 10=0.961, 50=0.798, 100=0.725, 1000=0.526, 10000=0.445 (USD); Mount: Surface Mount; Weight: 0.022g; Contact Material: Silver; Min Operating Temperature: -25°C; Max Operating Temperature: 70°C; Packaging: Tape and Reel; Package Quantity: 1; Max Voltage Rating (DC): 12V; Contact Current Rating: 50mA; Current Rating: 50mA; Termination: SMD/SMT; Electrical Life: 100000Cycles; Orientation: Right Angle; Insulation Resistance: 100MR; Length: 4mm; Depth: 3.2mm; REACH SVHC: Unknown; Lead Free: Lead Free; ComponentLink1URL: https://datasheet.ciiva.com/1634/60838-1634400.pdf; ComponentLink1Description: https://datasheet.ciiva.com/1634/60838-1634400.pdf; ComponentLink2URL: https://datasheet.ciiva.com/2900/b3u-1110-2900035.pdf; ComponentLink2Description: https://datasheet.ciiva.com/2900/b3u-1110-2900035.pdf; ComponentLink3URL: https://datasheet.ciiva.com/2900/b3u-1110-2900036.pdf; ComponentLink3Description: https://datasheet.ciiva.com/2900/b3u-1110-2900036.pdf; ComponentLink4URL: https://datasheet.ciiva.com/2900/b3u-1110-2900037.pdf; ComponentLink4Description: https://datasheet.ciiva.com/2900/b3u-1110-2900037.pdf; ComponentLink5URL: https://datasheet.ciiva.com/1532/60838-1532682.pdf; ComponentLink5Description: https://datasheet.ciiva.com/1532/60838-1532682.pdf; ComponentLink6URL: https://datasheet.ciiva.com/16863/70176037-16863994.pdf; ComponentLink6Description: https://datasheet.ciiva.com/16863/70176037-16863994.pdf; ComponentLink7URL: https://datasheet.ciiva.com/14142/b3u-eng-datasheet-14142542.pdf; ComponentLink7Description: https://datasheet.ciiva.com/14142/b3u-eng-datasheet-14142542.pdf; ComponentLink8URL: https://datasheet.ciiva.com/30158/en-b3u-30158606.pdf; ComponentLink8Description: https://datasheet.ciiva.com/30158/en-b3u-30158606.pdf
U1 = LSM9DS1: Manufacturer: STMicroelectronics; Manufacturer Part Number: LSM9DS1TR; Description 1: STMICROELECTRONICS         LSM9DS1TR             MEMS Module, I2C/SPI, Tri-Axis Gyroscope, Tri-Axis Accelerometer, Tri-Axis Magnetometer, 1.9 V; Sensor Type: Accelerometer,Gyroscope,Magnetometer,3 Axis; Min Supply Voltage: 1.9V; Max Supply Voltage: 3.6V; Output Type: SPI,I2C; Supplier 1: Mouser; Supplier Part Number 1: 511-LSM9DS1TR; Stock 1: 5520; Pricing 1: 1=6.14, 10=5.55, 50=5.3, 100=4.6, 1000=3.49, 10000=3.1 (USD); Case/Package: LGA; Number of Pins: 24; Min Operating Temperature: -40°C; Max Operating Temperature: 85°C; Packaging: Cut Tape; Lead Free: Lead Free; REACH SVHC: No SVHC; ComponentLink1URL: http://www.farnell.com/datasheets/2028150.pdf; ComponentLink1Description: http://www.farnell.com/datasheets/2028150.pdf; ComponentLink2URL: http://www.st.com/content/ccc/resource/technical/document/datasheet/1e/3f/2a/d6/25/eb/48/46/DM00103319.pdf/files/DM00103319.pdf/jcr:content/translations/en.DM00103319.pdf; ComponentLink2Description: http://www.st.com/content/ccc/resource/technical/document/datasheet/1e/3f/2a/d6/25/eb/48/46/DM00103319.pdf/files/DM00103319.pdf/jcr:content/translations/en.DM00103319.pdf; ComponentLink3URL: https://www.mouser.com/ds/2/389/lsm9ds1-955071.pdf; ComponentLink3Description: https://www.mouser.com/ds/2/389/lsm9ds1-955071.pdf
U2 = FT201XQ-R: USB to I2C Interface Chip, UHCI/OHCI/EHCI Compatible, USB 2.0 Compatible, -40 to +85 degC, 16-Pin QFN, Pb-Free, Tape and Reel; Manufacturer: FTDI; Description 1: IC USB FS I2C 16QFN; Operating Supply Voltage: 5.5V; Data Rate: 12Mbps; Interface: I2C,USB; Operating Supply Current: 8mA; Supplier 1: Digi-Key; Supplier Part Number 1: 768-1131-1-ND; Manufacturer Part Number: FT201XQ-R; Stock 1: 2248; Pricing 1: 1=2.04, 25=1.97, 100=1.9, 250=1.71, 500=1.54, 1000=1.4806 (USD); Mount: Surface Mount; Case/Package: QFN; Number of Pins: 16; Weight: 0.002014oz; Min Operating Temperature: -40°C; Max Operating Temperature: 85°C; Packaging: Tape and Reel; Package Quantity: 5000; Length: 4mm; Height: 0.75mm; Width: 4mm; Lead Free: Lead Free; ComponentLink1URL: https://datasheet.ciiva.com/14668/0900766b811020ab-14668386.pdf; ComponentLink1Description: https://datasheet.ciiva.com/14668/0900766b811020ab-14668386.pdf; ComponentLink2URL: https://datasheet.ciiva.com/1784/ft-x-series-1784572.pdf; ComponentLink2Description: https://datasheet.ciiva.com/1784/ft-x-series-1784572.pdf; ComponentLink3URL: https://datasheet.ciiva.com/1784/ft-x-series-1784573.pdf; ComponentLink3Description: https://datasheet.ciiva.com/1784/ft-x-series-1784573.pdf; ComponentLink4URL: https://datasheet.ciiva.com/1784/ft-x-series-1784574.pdf; ComponentLink4Description: https://datasheet.ciiva.com/1784/ft-x-series-1784574.pdf
U3 = CYBLE-222014-01: Manufacturer: Cypress; Description 1: Bluetooth Class II 1.8V to 5.5V 1000Kbps 22-Pin SMD T/R; Frequency: 2.4GHz; Data Rate: 1Mbps; Sensitivity: -91dBm; Memory Size: 32KB; Interface: I2C,SPI,UART; Current - Receiving: 16.4mA; Current - Transmitting: 15.6mA; Operating Supply Voltage: 5.5V; Supplier 1: Digi-Key; Supplier Part Number 1: 428-3583-1-ND; Manufacturer Part Number: CYBLE-222014-01; Stock 1: 1017; Pricing 1: 1=14.77, 10=13.367, 25=12.3112, 100=11.256, 250=10.5525 (USD); Mount: Surface Mount; Case/Package: SMD/SMT; Min Operating Temperature: -40°C; Max Operating Temperature: 85°C; Packaging: Tape and Reel; ComponentLink1URL: http://www.cypress.com/file/230691/download; ComponentLink1Description: http://www.cypress.com/file/230691/download
U4 = TMP116: Manufacturer: Texas Instruments; Manufacturer Part Number: TMP116AIDRVT; Interface: I2C,SMBus,2-Wire; Supplier 1: Digi-Key; Supplier Part Number 1: 296-46944-1-ND; Stock 1: 995; Pricing 1: 1=4.01, 10=3.599, 100=2.9485 (USD); Min Operating Temperature: -55°C; Max Operating Temperature: 150°C
U6 = LTC4063: Manufacturer: Analog Devices / Linear Technology; Manufacturer Part Number: LTC4063EDD#PBF; Description 1: LINEAR TECHNOLOGY         LTC4063EDD#PBF            IC, BATT CHARGER, W/MP LDO, 10DFN; Number of Cells: 1; Max Supply Voltage: 8V; Min Supply Voltage: 4.3V; Output Current: 800uA; Output Voltage: 4.2V; Max Charge Current: 1A; Supplier 1: Digi-Key; Supplier Part Number 1: LTC4063EDD#PBF-ND; Stock 1: 576; Pricing 1: 1=4.36, 25=2.8928, 100=2.2848 (USD); Case/Package: DFN EP; Number of Pins: 10; Min Operating Temperature: -40°C; Max Operating Temperature: 85°C; Package Quantity: 121; Packaging: Rail/Tube; Max Input Voltage: 8V; Min Input Voltage: 4.3V; Radiation Hardening: No; REACH SVHC: No SVHC; Lead Free: Lead Free; ComponentLink1URL: https://datasheet.ciiva.com/1139/1716146-1139992.pdf; ComponentLink1Description: https://datasheet.ciiva.com/1139/1716146-1139992.pdf; ComponentLink2URL: https://datasheet.ciiva.com/1145/79586-1145020.pdf; ComponentLink2Description: https://datasheet.ciiva.com/1145/79586-1145020.pdf; ComponentLink3URL: https://datasheet.ciiva.com/15114/getdatasheetpartid-366882-15114670.pdf; ComponentLink3Description: https://datasheet.ciiva.com/15114/getdatasheetpartid-366882-15114670.pdf; ComponentLink4URL: https://datasheet.ciiva.com/48696/001255656-da-01-en-ic-batt-chrgr-ltc4063edd-pbf-dfn-10-ltc-48696044.pdf; ComponentLink4Description: https://datasheet.ciiva.com/48696/001255656-da-01-en-ic-batt-chrgr-ltc4063edd-pbf-dfn-10-ltc-48696044.pdf
U7 = MAX17043G: Manufacturer: Maxim; Manufacturer Part Number: MAX17043G+T; Description 1: IC 2-WIRE FG MODEL GAUGE LO BATT; Supplier 1: Mouser; Supplier Part Number 1: 700-MAX17043G+T; Stock 1: 10717; Pricing 1: 1=3.67, 10=3.52, 50=1.85, 100=1.7, 1000=1.66, 10000=1.66 (USD); Mount: Surface Mount; Number of Pins: 8; Contact Plating: Tin,Matte; Min Operating Temperature: -20°C; Max Operating Temperature: 70°C; Packaging: Tape and Reel; Package Quantity: 10000; Radiation Hardening: No; ComponentLink1URL: https://datasheet.ciiva.com/1935/max17043-max17044-1935697.pdf; ComponentLink1Description: https://datasheet.ciiva.com/1935/max17043-max17044-1935697.pdf
U8 = TI-SN74XXX1XX4-XX-5: SN74AHC1G04DBVR; Manufacturer: Texas Instruments; Description 1: IC SINGLE INVERTER GATE SOT23-5; Logic Function: Buffer,Inverter,Inverting; Number of Elements: 1; Max Output Current: 8mA; Max Supply Voltage: 5.5V; Min Supply Voltage: 2V; Propagation Delay: 7.5ns; Quiescent Current: 1uA; High Level Output Current: -8mA; Turn-On Delay Time: 12ns; Schmitt Trigger Input: No; Supplier 1: Mouser; Supplier Part Number 1: 595-SN74AHC1G04DBVR; Manufacturer Part Number: SN74AHC1G04DBVR; Stock 1: 27929; Pricing 1: 1=0.43, 10=0.289, 50=0.289, 100=0.137, 1000=0.106, 10000=0.08 (USD); Mount: Surface Mount; Case/Package: SOT-23; Number of Pins: 5; Weight: 0.000557oz; Contact Plating: Tin,Matte; Min Operating Temperature: -40°C; Max Operating Temperature: 125°C; Packaging: Tape and Reel; Package Quantity: 1; Number of Inputs: 1; Output Current: 8mA; Number of Gates: 1; Number of Circuits: 1; Low Level Output Current: 8mA; Termination: SMD/SMT; Number of Bits: 1; Length: 2.9mm; Height: 1.15mm; Width: 1.6mm; Radiation Hardening: No; REACH SVHC: No SVHC; Lead Free: Lead Free; ComponentLink1URL: https://datasheet.ciiva.com/4827/scls318q-100390-4827313.pdf; ComponentLink1Description: https://datasheet.ciiva.com/4827/scls318q-100390-4827313.pdf; ComponentLink2URL: https://datasheet.ciiva.com/1864/sn74ahc1g04-1864386.pdf; ComponentLink2Description: https://datasheet.ciiva.com/1864/sn74ahc1g04-1864386.pdf; ComponentLink3URL: https://datasheet.ciiva.com/14132/sn74ahc1g04-eng-tds-14132658.pdf; ComponentLink3Description: https://datasheet.ciiva.com/14132/sn74ahc1g04-eng-tds-14132658.pdf; ComponentLink4URL: https://datasheet.ciiva.com/1864/sn74ahc1g04-1864387.pdf; ComponentLink4Description: https://datasheet.ciiva.com/1864/sn74ahc1g04-1864387.pdf; ComponentLink5URL: https://datasheet.ciiva.com/1864/sn74ahc1g04-1864388.pdf; ComponentLink5Description: https://datasheet.ciiva.com/1864/sn74ahc1g04-1864388.pdf; ComponentLink6URL: https://datasheet.ciiva.com/15089/getdatasheetpartid-190014-15089365.pdf; ComponentLink6Description: https://datasheet.ciiva.com/15089/getdatasheetpartid-190014-15089365.pdf; ComponentLink7URL: https://datasheet.ciiva.com/46384/1882758-46384389.pdf; ComponentLink7Description: https://datasheet.ciiva.com/46384/1882758-46384389.pdf; ComponentLink8URL: https://datasheet.ciiva.com/46430/1834091-46430923.pdf; ComponentLink8Description: https://datasheet.ciiva.com/46430/1834091-46430923.pdf; ComponentLink9URL: https://datasheet.ciiva.com/4219/1511sn74ahc1g04-4219564.pdf; ComponentLink9Description: https://datasheet.ciiva.com/4219/1511sn74ahc1g04-4219564.pdf; ComponentLink10URL: https://datasheet.ciiva.com/7783/1759812-7783196.pdf; ComponentLink10Description: https://datasheet.ciiva.com/7783/1759812-7783196.pdf; ComponentLink11URL: https://datasheet.ciiva.com/16464/sn74ahc1g04-16464940.pdf; ComponentLink11Description: https://datasheet.ciiva.com/16464/sn74ahc1g04-16464940.pdf; ComponentLink12URL: https://datasheet.ciiva.com/7783/1759812-7783197.pdf; ComponentLink12Description: https://datasheet.ciiva.com/7783/1759812-7783197.pdf; ComponentLink13URL: https://datasheet.ciiva.com/27052/1384368-27052143.pdf; ComponentLink13Description: https://datasheet.ciiva.com/27052/1384368-27052143.pdf; ComponentLink14URL: https://datasheet.ciiva.com/48703/001074492-da-01-en-ic-single-i-sn74ahc1g04dbvr-sot-23-5-tid-48703786.pdf; ComponentLink14Description: https://datasheet.ciiva.com/48703/001074492-da-01-en-ic-single-i-sn74ahc1g04dbvr-sot-23-5-tid-48703786.pdf
U9 = TI-SN74XXX1G80-5: Manufacturer: Texas Instruments; Manufacturer Part Number: SN74AUP1G80DBVR; Description 1: IC D-TYPE POS TRG SNGL SOT23-5; Frequency: 280MHz; Propagation Delay: 17.7ns; Polarity: Inverting; Number of Bits: 1; Logic Function: D-Type; Clock Edge Trigger Type: Positive Edge; Max Supply Voltage: 3.6V; Min Supply Voltage: 800mV; Turn-On Delay Time: 3.1ns; High Level Output Current: -4mA; Low Level Output Current: 4mA; Supplier 1: Mouser; Supplier Part Number 1: 595-SN74AUP1G80DBVR; Stock 1: 3731; Pricing 1: 1=0.35, 10=0.266, 50=0.266, 100=0.144, 1000=0.108, 10000=0.087 (USD); Mount: Surface Mount; Case/Package: SOT-23; Number of Pins: 5; Weight: 0.000395oz; Min Operating Temperature: -40°C; Max Operating Temperature: 85°C; Packaging: Tape and Reel; Number of Outputs: 1; Package Quantity: 3000; Number of Elements: 1; Number of Bits per Element: 1; Number of Circuits: 1; Number of Input Lines: 1; Number of Output Lines: 1; Radiation Hardening: No; REACH SVHC: No SVHC; Lead Free: Lead Free; ComponentLink1URL: https://datasheet.ciiva.com/15091/getdatasheetpartid-194395-15091600.pdf; ComponentLink1Description: https://datasheet.ciiva.com/15091/getdatasheetpartid-194395-15091600.pdf; ComponentLink2URL: https://datasheet.ciiva.com/1854/sn74aup1g80-1854806.pdf; ComponentLink2Description: https://datasheet.ciiva.com/1854/sn74aup1g80-1854806.pdf; ComponentLink3URL: https://datasheet.ciiva.com/1854/sn74aup1g80-1854807.pdf; ComponentLink3Description: https://datasheet.ciiva.com/1854/sn74aup1g80-1854807.pdf; ComponentLink4URL: https://datasheet.ciiva.com/1854/sn74aup1g80-1854808.pdf; ComponentLink4Description: https://datasheet.ciiva.com/1854/sn74aup1g80-1854808.pdf; ComponentLink5URL: https://datasheet.ciiva.com/14313/sces593e-14313482.pdf; ComponentLink5Description: https://datasheet.ciiva.com/14313/sces593e-14313482.pdf; ComponentLink6URL: https://datasheet.ciiva.com/14292/sn74aup1g80-14292862.pdf; ComponentLink6Description: https://datasheet.ciiva.com/14292/sn74aup1g80-14292862.pdf